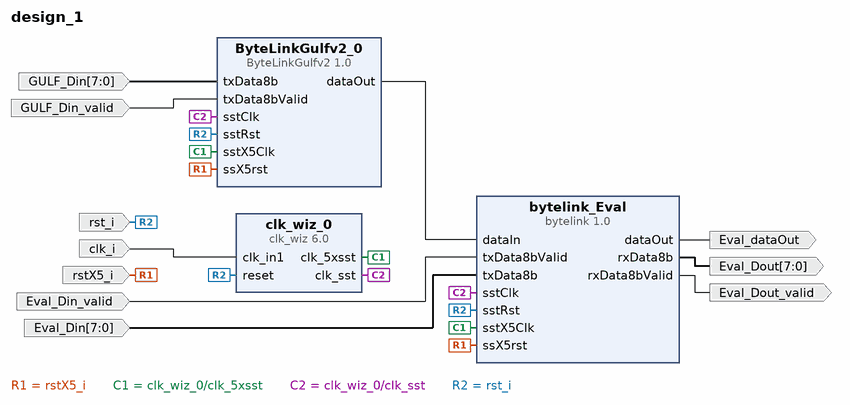
[diagram p0: block diagram of the top level]
# Vivado block design design_1, xc7z020clg400-3, Vivado 2018.2
create_bd_design design_1

create_bd_port -dir I -from 7 -to 0 Eval_Din
create_bd_port -dir I Eval_Din_valid
create_bd_port -dir O Eval_Dout_valid
create_bd_port -dir O -from 7 -to 0 Eval_Dout
create_bd_port -dir I clk_i
create_bd_port -dir O Eval_dataOut
create_bd_port -dir I rstX5_i
create_bd_port -dir I rst_i
create_bd_port -dir I -from 7 -to 0 GULF_Din
create_bd_port -dir I GULF_Din_valid

create_bd_cell -type ip -vlnv xilinx.com:ip:clk_wiz:6.0 clk_wiz_0
set_property -dict [list \
  CONFIG.CLKOUT2_USED true \
  CONFIG.NUM_OUT_CLKS 2 \
  CONFIG.CLK_OUT1_PORT clk_sst \
  CONFIG.CLK_OUT2_PORT clk_5xsst \
  CONFIG.CLKOUT1_REQUESTED_OUT_FREQ 25 \
  CONFIG.CLKOUT2_REQUESTED_OUT_FREQ 125 \
  CONFIG.USE_LOCKED false \
  CONFIG.MMCM_DIVCLK_DIVIDE 1 \
  CONFIG.MMCM_CLKOUT0_DIVIDE_F 40.000 \
  CONFIG.MMCM_CLKOUT1_DIVIDE 8 \
  CONFIG.CLKOUT1_JITTER 175.402 \
  CONFIG.CLKOUT2_JITTER 125.247 \
  CONFIG.CLKOUT2_PHASE_ERROR 98.575 \
] [get_bd_cells clk_wiz_0]
create_bd_cell -type ip -vlnv IDLAB:HMB:bytelink:1.0 bytelink_Eval
create_bd_cell -type ip -vlnv xilinx.com:user:ByteLinkGulfv2:1.0 ByteLinkGulfv2_0

# ---- connections ----

connect_bd_net [get_bd_ports clk_i] [get_bd_pins clk_wiz_0/clk_in1]
connect_bd_net [get_bd_ports rstX5_i] [get_bd_pins bytelink_Eval/ssX5rst] [get_bd_pins ByteLinkGulfv2_0/ssX5rst]
connect_bd_net [get_bd_pins clk_wiz_0/clk_5xsst] [get_bd_pins bytelink_Eval/sstX5Clk] [get_bd_pins ByteLinkGulfv2_0/sstX5Clk]
connect_bd_net [get_bd_pins clk_wiz_0/clk_sst] [get_bd_pins bytelink_Eval/sstClk] [get_bd_pins ByteLinkGulfv2_0/sstClk]
connect_bd_net [get_bd_ports rst_i] [get_bd_pins clk_wiz_0/reset] [get_bd_pins bytelink_Eval/sstRst] [get_bd_pins ByteLinkGulfv2_0/sstRst]
connect_bd_net [get_bd_ports GULF_Din] [get_bd_pins ByteLinkGulfv2_0/txData8b]
connect_bd_net [get_bd_ports GULF_Din_valid] [get_bd_pins ByteLinkGulfv2_0/txData8bValid]
connect_bd_net -net bytelink_0_dataOut [get_bd_pins bytelink_Eval/dataOut] [get_bd_ports Eval_dataOut]
connect_bd_net -net bytelink_0_rxData8b [get_bd_pins bytelink_Eval/rxData8b] [get_bd_ports Eval_Dout]
connect_bd_net -net bytelink_0_rxData8bValid [get_bd_pins bytelink_Eval/rxData8bValid] [get_bd_ports Eval_Dout_valid]
connect_bd_net [get_bd_pins ByteLinkGulfv2_0/dataOut] [get_bd_pins bytelink_Eval/dataIn]
connect_bd_net [get_bd_ports Eval_Din_valid] [get_bd_pins bytelink_Eval/txData8bValid]
connect_bd_net [get_bd_ports Eval_Din] [get_bd_pins bytelink_Eval/txData8b]

validate_bd_design
save_bd_design
